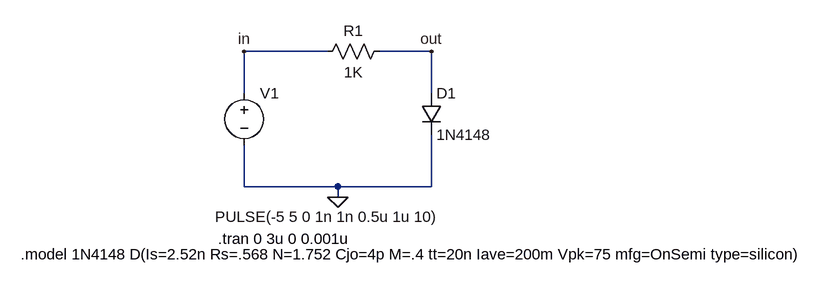
[diagram p0: schematic 3_PulseTrain_Response_Diodo_PN_1n4148.asc]
3_PulseTrain_Response_Diodo_PN_1n4148.asc, the LTspice schematic file:
Version 4
SHEET 1 1172 680
WIRE 256 16 128 16
WIRE 416 16 336 16
WIRE 128 80 128 16
WIRE 416 80 416 16
WIRE 128 224 128 160
WIRE 272 224 128 224
WIRE 416 224 416 144
WIRE 416 224 272 224
WIRE 272 240 272 224
FLAG 272 240 0
FLAG 128 16 in
FLAG 416 16 out
SYMBOL res 352 0 R90
WINDOW 0 0 56 VBottom 2
WINDOW 3 32 56 VTop 2
SYMATTR InstName R1
SYMATTR Value 1K
SYMBOL diode 400 80 R0
SYMATTR InstName D1
SYMATTR Value 1N4148
SYMBOL voltage 128 64 R0
WINDOW 3 -45 206 Left 2
WINDOW 123 0 0 Left 0
WINDOW 39 0 0 Left 0
SYMATTR InstName V1
SYMATTR Value PULSE(-5 5 0 1n 1n 0.5u 1u 10)
TEXT 88 304 Left 2 !.tran 0 3u 0 0.001u
TEXT -216 328 Left 2 !.model 1N4148 D(Is=2.52n Rs=.568 N=1.752 Cjo=4p M=.4 tt=20n Iave=200m Vpk=75 mfg=OnSemi type=silicon)

The netlist it stands for:
* 3_PulseTrain_Response_Diodo_PN_1n4148.asc
R1 out in 1K
D1 out 0 1N4148
V1 in 0 PULSE(-5 5 0 1n 1n 0.5u 1u 10)
.model D D
.lib standard.dio
.tran 0 3u 0 0.001u
.model 1N4148 D(Is=2.52n Rs=.568 N=1.752 Cjo=4p M=.4 tt=20n Iave=200m Vpk=75 mfg=OnSemi type=silicon)
.backanno
.end